# EAGLE design mouth-mouse (EAGLE 5.10)
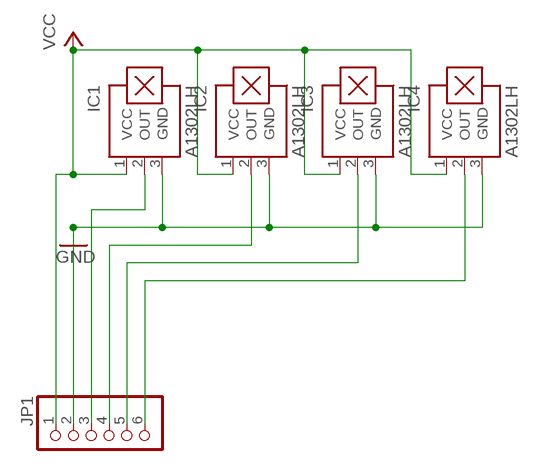
[diagram p0: schematic, sheet 1]

## Parts
IC1  A1302LH  [SOT23-W]
IC2  A1302LH  [SOT23-W]
IC3  A1302LH  [SOT23-W]
IC4  A1302LH  [SOT23-W]
JP1  PINHD-1X6  [1X06]

## Nets
GND: IC1.3(GND) IC2.3(GND) IC3.3(GND) IC4.3(GND) JP1.2
N$15: IC1.2(OUT) JP1.3
N$16: IC2.2(OUT) JP1.4
N$17: IC3.2(OUT) JP1.5
N$18: IC4.2(OUT) JP1.6
VCC: IC1.1(VCC) IC2.1(VCC) IC3.1(VCC) IC4.1(VCC) JP1.1

## Library data of the parts
IC1-IC4 = allegro:A13*?: Linear Hall Effect Sensor ICs Continuous-Time Ratiometric High-Temperature Operation Programmable Linear with Analog Output A1302 -Replacement- UGN3503 Source: http://www.allegromicro.com/en/Products/Part_Numbers/1301/1301.pdf http://www.allegromicro.com/en/Products/Part_Numbers/1321/1321.pdf http://www.allegromicro.com/en/Products/Part_Numbers/1381/1381.pdf
JP1 = pinhead:PINHD-1X6: PIN HEADER

## Board
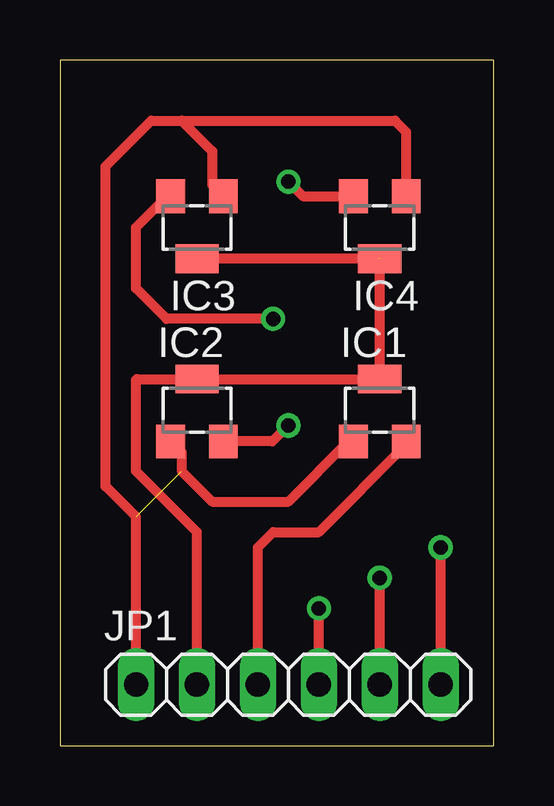
[diagram p1: board, top side]
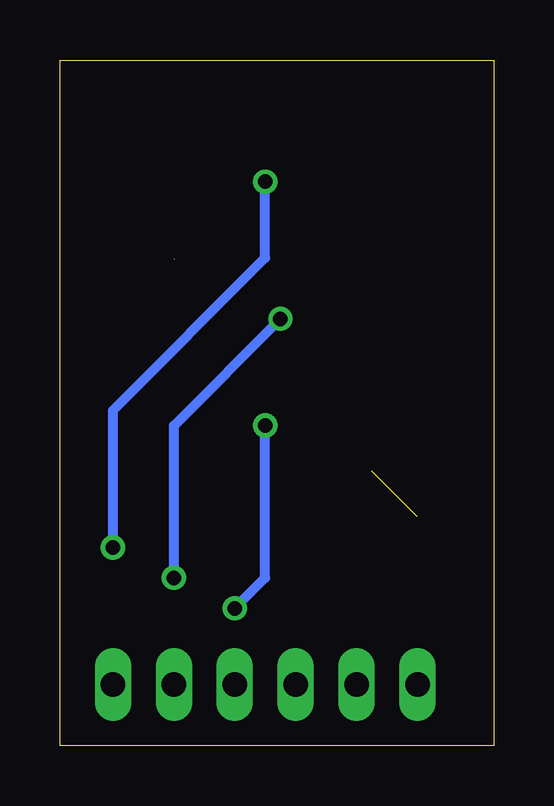
[diagram p2: board, bottom side, seen from below]

Size 18.09 x 28.57 mm. Coordinates in mm from the lower left corner, seen from the top.
Outline: 0,0 18.09,0 18.09,28.57 0,28.57 0,0
Copper layers (1*16): Top 0.035mm / dielectric 1.5mm / Bottom 0.035mm
Design rules "default": minimum track width 10mil, minimum drill 24mil, track to track 8mil, track to pad 8mil, pad to pad 8mil, via to via 8mil, smd to smd 8mil, copper to edge 40mil, drill to drill 8mil, minimum pad ring 10mil, minimum via ring 8mil, stop-mask expansion 4mil, vias tented up to drill 0mil, thermal gap 10mil

### Footprints (pad centres in the part's own frame; a part is rotated, then mirrored left to right if it is on the bottom)
SOT23-W = smd 1.2 x 1.4: 1 -1.1,-1.3; 2 1.1,-1.3 | smd 1.8 x 1.2: 3 0,1.3
1X06 = drill 1.016 long: 1 -6.35,0; 2 -3.81,0; 3 -1.27,0; 4 1.27,0; 5 3.81,0; 6 6.35,0

### Placement (x,y rotation side)
IC1  13.34,13.97 0 top
IC2  5.71,13.97 0 top
IC3  5.71,21.59 180 top
IC4  13.34,21.59 180 top
JP1  9.53,2.54 0 top

### Tracks (layer width: path | path; a pad name or v marks a point on that pad's centre or on a via)
GND  (1 unrouted)
  Top 0.406: 13.3,20.29 13.34,20.32 | IC3.3 IC4.3 IC1.3 IC2.3 3.21,15.27 3.17,15.24 3.17,11.43 5.71,8.89 JP1.2
N$15
  Top 0.406: IC1.2 14.44,12.53 10.79,8.89 8.89,8.89 8.26,8.26 JP1.3
N$16  (via drill 0.6)
  Top 0.406: IC2.2 8.86,12.67 v9.53,13.34 | JP1.4 v10.79,5.71
  Bottom 0.406: v9.53,13.34 9.53,6.99 v10.79,5.71
N$17  (via drill 0.6)
  Top 0.406: IC3.2 4.47,22.89 3.17,21.59 3.17,19.05 4.45,17.78 v8.89,17.78 | JP1.5 v13.34,6.99
  Bottom 0.406: v13.34,6.99 13.34,13.34 v8.89,17.78
N$18  (via drill 0.6)
  Top 0.406: IC4.2 10.13,22.89 v9.53,23.5 | JP1.6 v15.88,8.26
  Bottom 0.406: v9.53,23.5 9.53,20.32 15.88,13.97 v15.88,8.26
VCC  (1 unrouted)
  Top 0.406: JP1.1 3.17,9.53 1.91,10.79 1.91,24.13 3.81,26.04 5.08,26.04 | 5.08,26.04 6.35,24.77 6.35,23.36 IC3.1 | IC4.1 14.44,25.57 13.97,26.04 5.08,26.04 | IC1.1 12.04,12.67 9.53,10.16 6.35,10.16 5.08,11.43 5.08,12.21 IC2.1